# EAGLE design lampica (EAGLE 7.7.0)
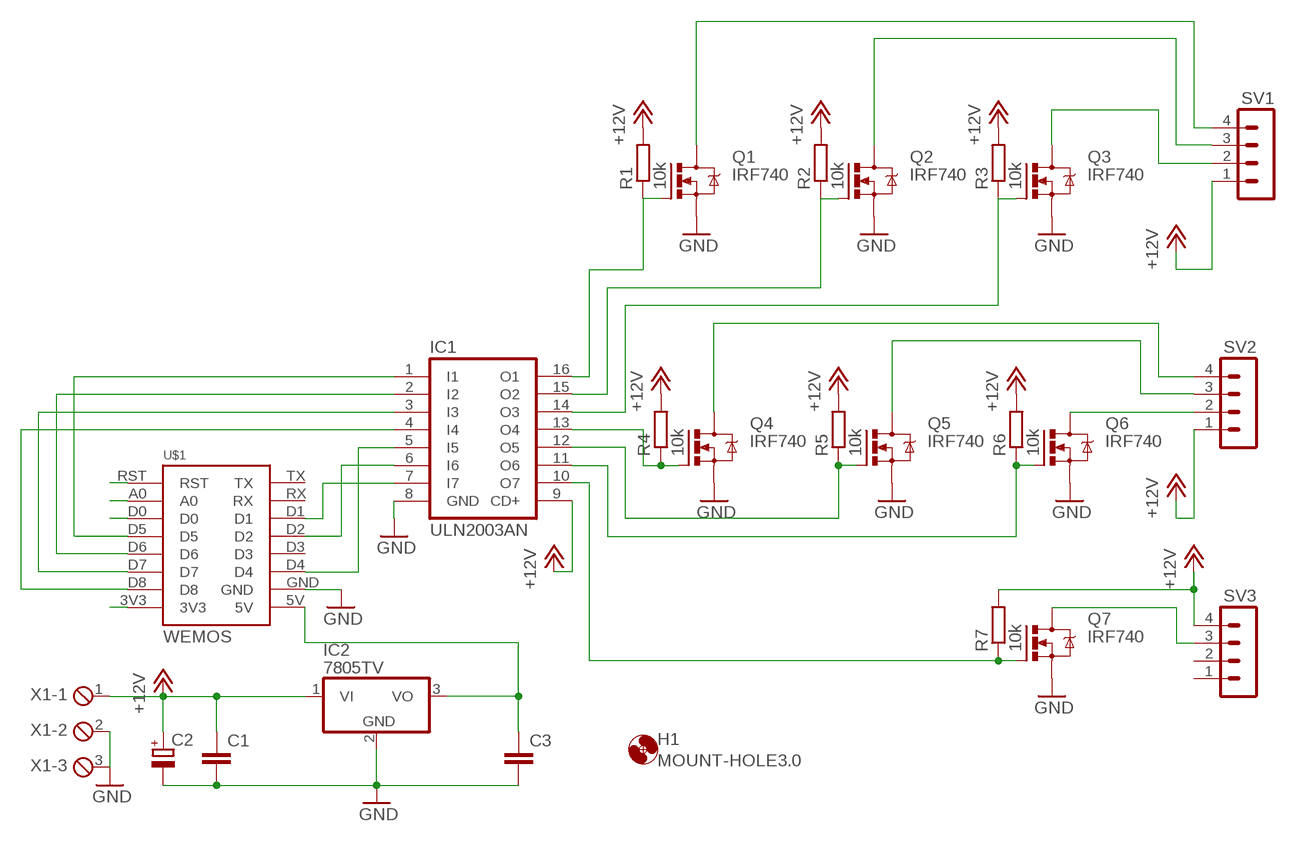
[diagram p0: schematic, sheet 1]

## Parts
C1  C-EU050-025X075  [C050-025X075]
C2  CPOL-EUE5-8.5  [E5-8,5]
C3  C-EU050-025X075  [C050-025X075]
H1  MOUNT-HOLE3.0  [3,0]
IC1  ULN2003AN  [DIL16]
IC2  7805TV  [TO220V]
Q1  IRF740  [TO220BV]
Q2  IRF740  [TO220BV]
Q3  IRF740  [TO220BV]
Q4  IRF740  [TO220BV]
Q5  IRF740  [TO220BV]
Q6  IRF740  [TO220BV]
Q7  IRF740  [TO220BV]
R1  10k  R-EU_0207/7  [0207/7]
R2  10k  R-EU_0207/7  [0207/7]
R3  10k  R-EU_0207/7  [0207/7]
R4  10k  R-EU_0207/10  [0207/10]
R5  10k  R-EU_0207/7  [0207/7]
R6  10k  R-EU_0207/7  [0207/7]
R7  10k  R-EU_0207/7  [0207/7]
SV1  MA04-1  [MA04-1]
SV2  MA04-1  [MA04-1]
SV3  MA04-1  [MA04-1]
U$1  WEMOS  [WEMOS]
X1  MPT3  [3POL254]

## Nets
+12V: C1.1 C2.+ IC1.9(CD+) IC2.1(VI) R1.2 R2.2 R3.2 R4.2 R5.2 R6.2 R7.2 SV1.1 SV2.1 SV3.4 X1.1
GND: C1.2 C2.- C3.2 IC1.8(GND) IC2.2(GND) Q1.S Q2.S Q3.S Q4.S Q5.S Q6.S Q7.S U$1.GND X1.2 X1.3
N$1: IC1.4(I4) U$1.D8
N$2: IC1.3(I3) U$1.D7
N$3: C3.1 IC2.3(VO) U$1.5V
N$4: IC1.2(I2) U$1.D6
N$5: IC1.1(I1) U$1.D5
N$6: IC1.5(I5) U$1.D4
N$7: IC1.6(I6) U$1.D2
N$8: IC1.7(I7) U$1.D1
N$9: IC1.11(O6) Q6.G R6.1
N$10: IC1.14(O3) Q3.G R3.1
N$11: IC1.12(O5) Q5.G R5.1
N$12: IC1.13(O4) Q4.G R4.1
N$13: Q4.D SV2.4
N$14: Q5.D SV2.3
N$15: Q6.D SV2.2
N$16: IC1.10(O7) Q7.G R7.1
N$17: Q7.D SV3.3
N$18: IC1.15(O2) Q2.G R2.1
N$19: IC1.16(O1) Q1.G R1.1
N$20: Q1.D SV1.4
N$21: U$1.A0
N$22: Q2.D SV1.3
N$23: Q3.D SV1.2
N$24: U$1.D0
N$29: U$1.3V3
N$30: U$1.RST
Unconnected: SV3.1 SV3.2 U$1.D3 U$1.RX U$1.TX

## Library data of the parts
C1 C3 = rcl:C-EU: CAPACITOR, European symbol
C2 = rcl:CPOL-EU: POLARIZED CAPACITOR, European symbol
H1 = holes:MOUNT-HOLE: MOUNTING HOLE with drill center marker
IC1 = uln-udn:ULN2003A: DRIVER ARRAY
IC2 = linear:78*: Positive VOLTAGE REGULATOR Source: http://cache.national.com/ds/LM/LM78L05.pdf http://www.fairchildsemi.com/ds/LM/LM7805.pdf
Q1-Q7 = transistor-power:IRF740: N-CHANNEL MOS FET
R1-R7 = rcl:R-EU_: RESISTOR, European symbol
SV1-SV3 = con-lstb:MA04-1: PIN HEADER; OC_FARNELL: unknown; OC_NEWARK: unknown
U$1 = 1455413453956-wemos:WEMOS
X1 = con-phoenix-254:MPT3: PHOENIX CONNECTOR; OC_FARNELL: unknown; OC_NEWARK: unknown

## Board
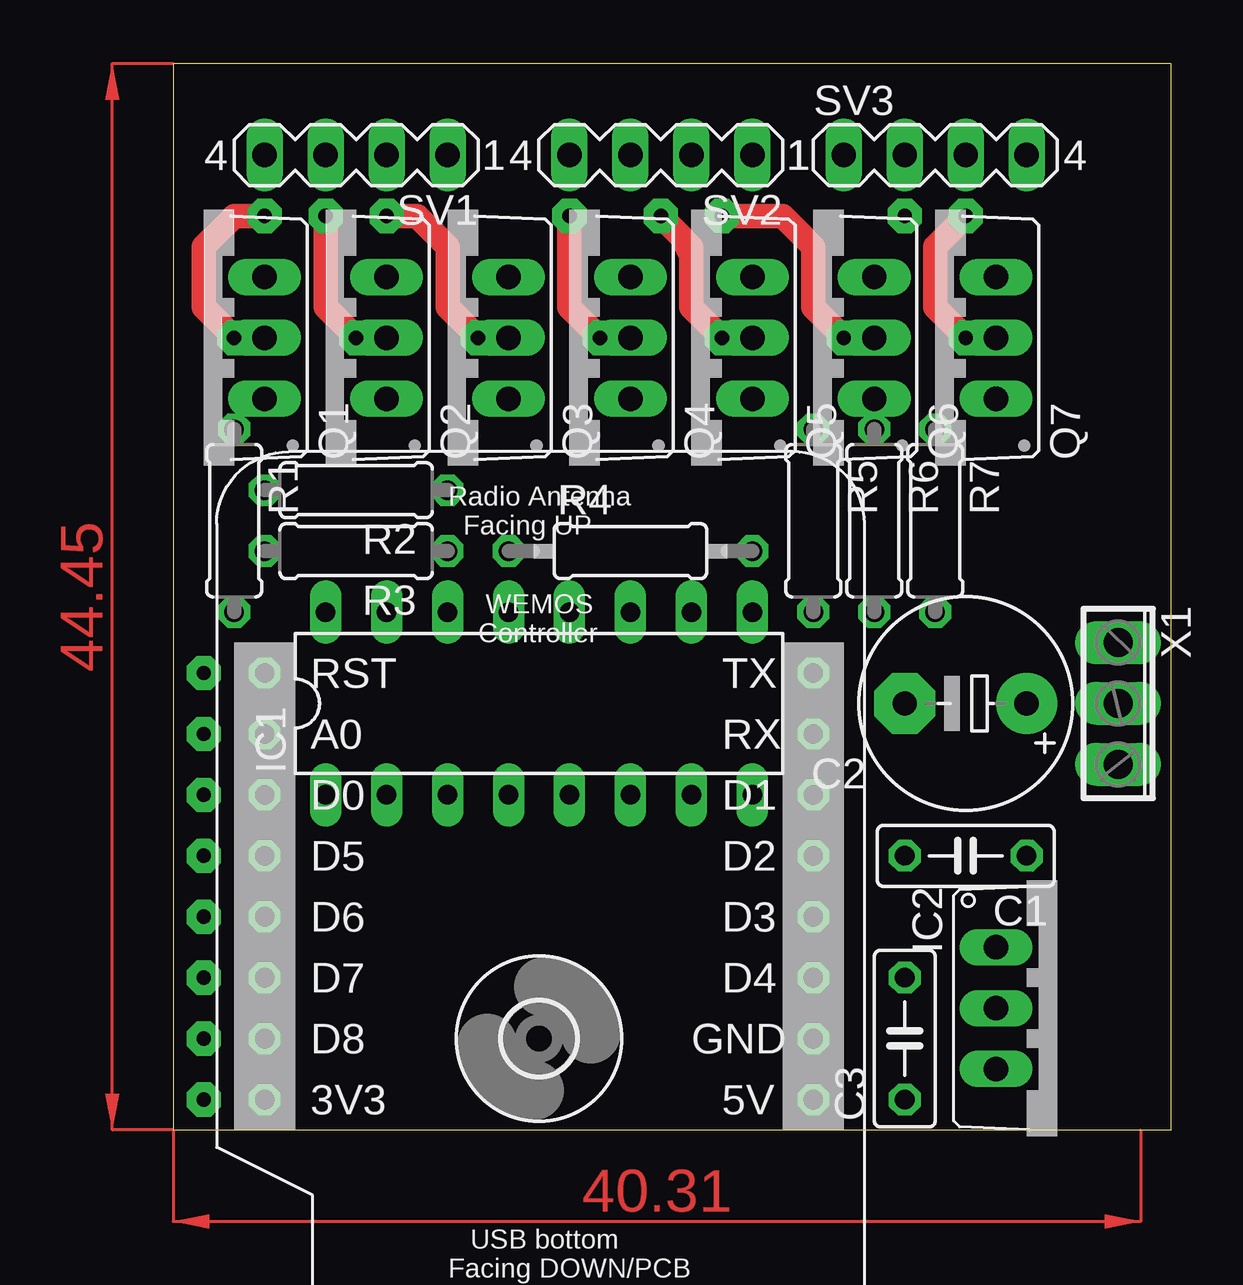
[diagram p1: board, top side]
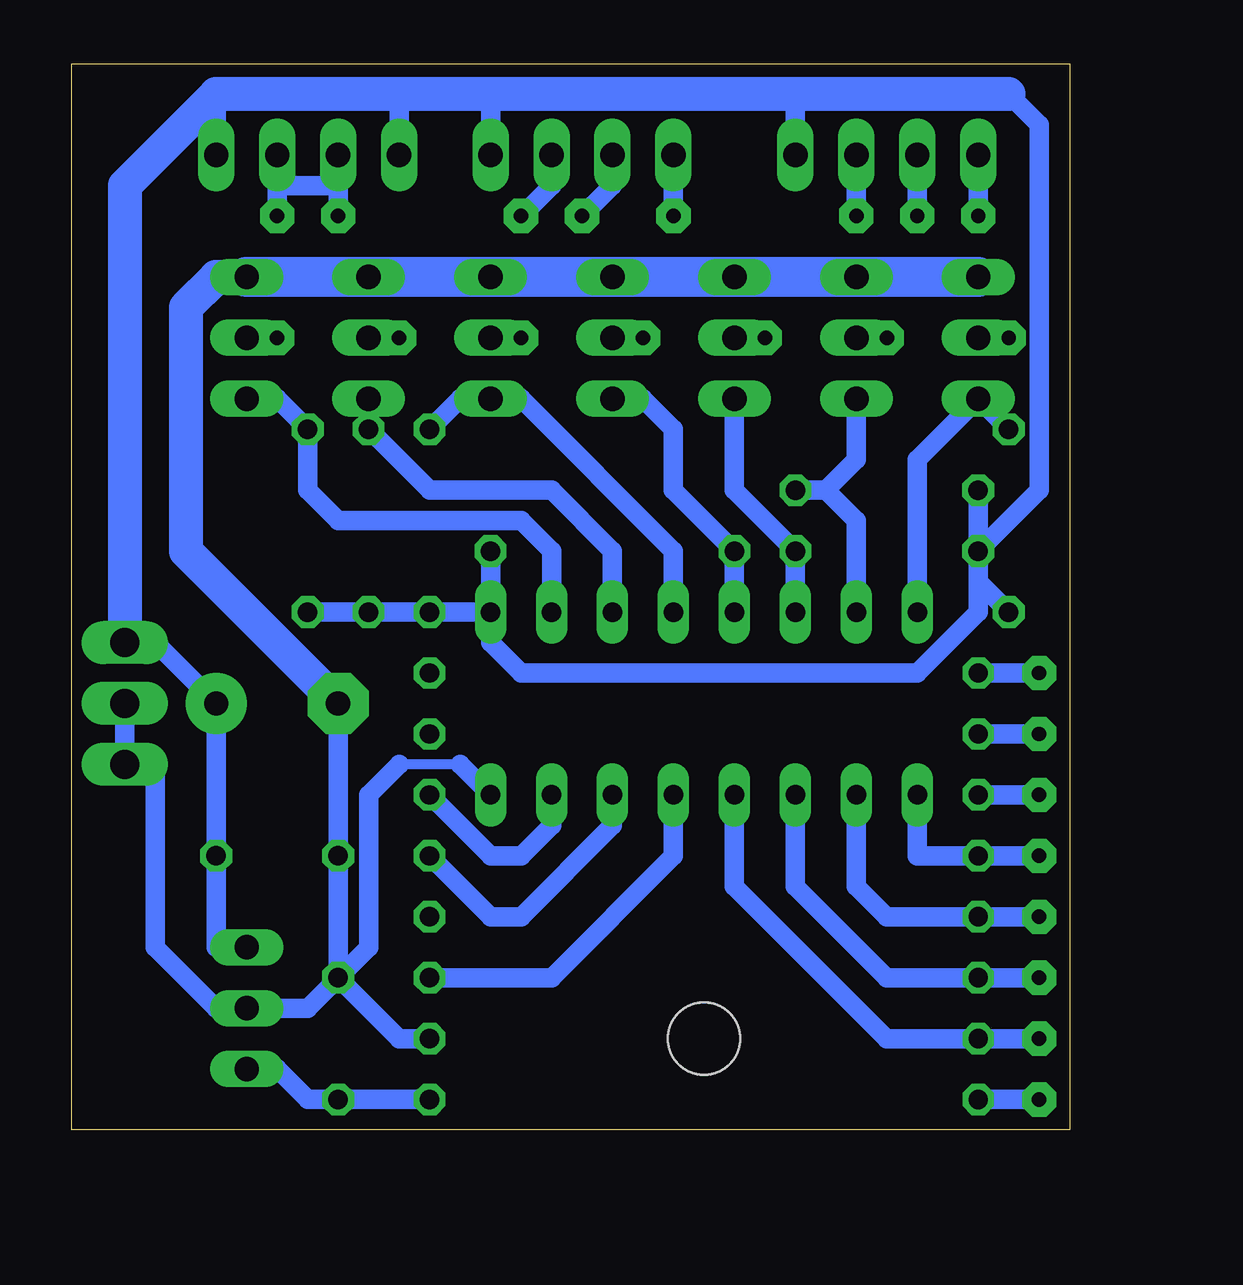
[diagram p2: board, bottom side, seen from below]

Size 41.58 x 44.44 mm. Coordinates in mm from the lower left corner, seen from the top.
Outline: 0,0 41.58,0 41.58,44.44 0,44.44 0,0
Copper layers (1*16): Top 0.035mm / dielectric 1.5mm / Bottom 0.035mm
Design rules "default": minimum track width 10mil, minimum drill 24mil, track to track 8mil, track to pad 8mil, pad to pad 8mil, via to via 8mil, smd to smd 8mil, copper to edge 40mil, drill to drill 8mil, minimum pad ring 10mil, minimum via ring 8mil, stop-mask expansion 4mil, vias tented up to drill 0mil, thermal gap 10mil

### Footprints (pad centres in the part's own frame; a part is rotated, then mirrored left to right if it is on the bottom)
C050-025X075 = drill 0.813 octagon: 1 -2.54,0; 2 2.54,0
E5-8,5 = drill 1.016 pad 2.54: + -2.54,0 | drill 1.016 pad 2.54 octagon: - 2.54,0
3,0 = hole 3: 0,0
DIL16 = drill 0.813 long: 1 -8.89,-3.81; 2 -6.35,-3.81; 3 -3.81,-3.81; 4 -1.27,-3.81; 5 1.27,-3.81; 6 3.81,-3.81; 7 6.35,-3.81; 8 8.89,-3.81; 9 8.89,3.81; 10 6.35,3.81; 11 3.81,3.81; 12 1.27,3.81; 13 -1.27,3.81; 14 -3.81,3.81; 15 -6.35,3.81; 16 -8.89,3.81
TO220V = drill 1.016 long: 1 -2.54,-2.54; 2 0,-2.54; 3 2.54,-2.54
TO220BV = drill 1.016 long: D 0,-2.54; G -2.54,-2.54; S 2.54,-2.54
0207/7 = drill 0.813 octagon: 1 -3.81,0; 2 3.81,0
0207/10 = drill 0.813 octagon: 1 -5.08,0; 2 5.08,0
MA04-1 = drill 1.016 long: 1 -3.81,0; 2 -1.27,0; 3 1.27,0; 4 3.81,0
WEMOS = drill 0.8 octagon: 3V3 0,0; 5V 22.86,0; A0 0,15.24; D0 0,12.7; D1 22.86,12.7; D2 22.86,10.16; D3 22.86,7.62; D4 22.86,5.08; D5 0,10.16; D6 0,7.62; D7 0,5.08; D8 0,2.54; GND 22.86,2.54; RST 0,17.78; RX 22.86,15.24; TX 22.86,17.78
3POL254 = drill 1.2 long: 1 -2.54,0; 2 0,0; 3 2.54,0

### Placement (x,y rotation side)
C1  33.02,11.43 180 top
C2  33.02,17.78 180 top
C3  30.48,3.81 90 top
H1  15.24,3.81 0 top
IC1  15.24,17.78 0 top
IC2  36.83,5.08 270 top
Q1  1.27,33.02 90 top
Q2  6.35,33.02 90 top
Q3  11.43,33.02 90 top
Q4  16.51,33.02 90 top
Q5  21.59,33.02 90 top
Q6  26.67,33.02 90 top
Q7  31.75,33.02 90 top
R1  2.54,25.4 270 top
R2  7.62,26.67 180 top
R3  7.62,24.13 180 top
R4  19.05,24.13 0 top
R5  26.67,25.4 270 top
R6  29.21,25.4 270 top
R7  31.75,25.4 270 top
SV1  7.62,40.64 180 top
SV2  20.32,40.64 180 top
SV3  31.75,40.64 0 top
U$1  3.81,1.27 0 top
X1  39.37,17.78 270 top

### Tracks (layer width: path | path; a pad name or v marks a point on that pad's centre or on a via)
+12V
  Bottom 0.813: IC2.1 35.56,7.62 C1.1 C2.+ 38.1,20.32 X1.1 | R2.2 R3.2 | R3.2 3.81,22.86 R1.2 | IC1.9 24.13,20.32 22.86,19.05 6.35,19.05 3.81,21.59 R3.2 | IC1.9 R5.2 R6.2 R7.2 | R4.2 IC1.9 | R3.2 1.27,26.67 1.27,41.91 2.54,43.18 11.43,43.18 | 27.94,43.18 35.56,43.18 SV3.4 | 27.94,43.18 24.13,43.18 | 24.13,43.18 11.43,43.18 | SV1.1 11.43,43.18 | SV2.1 24.13,43.18 | 27.94,43.18 27.94,41.91
  Bottom 1.422: 2.54,43.18 35.56,43.18 39.37,39.37 X1.1
GND
  Bottom 0.406: 25.4,15.24 27.94,15.24
  Bottom 0.813: U$1.GND 27.94,3.81 C3.2 | IC1.8 25.4,15.24 | C3.2 29.21,7.62 29.21,13.97 27.94,15.24 | C3.2 31.75,5.08 IC2.2 35.56,5.08 38.1,7.62 38.1,15.24 X1.3 X1.2 | C2.- C1.2 C3.2 | Q1.S Q2.S Q3.S Q4.S Q5.S Q6.S Q7.S
  Bottom 1.422: Q7.S 35.56,35.56 36.83,34.29 36.83,24.13 C2.-
  Bottom 1.676: Q1.S Q7.S
N$1  (via drill 0.6 pad 1.42)
  Bottom 0.813: IC1.4 13.97,10.16 7.62,3.81 U$1.D8 v1.27,3.81
N$2  (via drill 0.6 pad 1.42)
  Bottom 0.813: IC1.3 11.43,10.16 7.62,6.35 U$1.D7 v1.27,6.35
N$3
  Bottom 0.813: U$1.5V C3.1 31.75,1.27 33.02,2.54 IC2.3
N$4  (via drill 0.6 pad 1.42)
  Bottom 0.813: IC1.2 8.89,10.16 7.62,8.89 U$1.D6 v1.27,8.89
N$5  (via drill 0.6 pad 1.42)
  Bottom 0.813: IC1.1 6.35,11.43 U$1.D5 v1.27,11.43
N$6
  Bottom 0.813: IC1.5 16.51,11.43 21.59,6.35 U$1.D4
N$7
  Bottom 0.813: U$1.D2 24.13,8.89 22.86,8.89 19.05,12.7 IC1.6
N$8
  Bottom 0.813: IC1.7 21.59,12.7 22.86,11.43 24.13,11.43 U$1.D1
N$9
  Bottom 0.813: IC1.11 19.05,24.13 21.59,26.67 26.67,26.67 R6.1 Q6.G
N$10
  Bottom 0.813: IC1.14 R3.1 13.97,26.67 Q3.G
N$11
  Bottom 0.813: IC1.12 16.51,24.13 22.86,30.48 Q5.G 25.4,30.48 R5.1
N$12
  Bottom 0.813: IC1.13 R4.1 16.51,26.67 16.51,29.21 17.78,30.48 Q4.G
N$13  (via drill 0.6 pad 1.42)
  Top 1.016: v16.51,38.1 16.51,34.29 v17.78,33.02 Q4.D
  Bottom 0.813: SV2.4 v16.51,38.1
N$14  (via drill 0.6 pad 1.42)
  Top 0.254: v20.32,38.1 21.59,35.56 | v22.86,33.02 Q5.D
  Top 1.016: v22.86,33.02 21.59,34.29 21.59,35.56 21.59,36.83 v20.32,38.1
  Bottom 0.813: SV2.3 19.05,39.37 v20.32,38.1
N$15  (via drill 0.6 pad 1.42)
  Top 1.016: v22.86,38.1 25.4,38.1 26.67,36.83 26.67,34.29 v27.94,33.02 Q6.D
  Bottom 0.813: SV2.2 21.59,39.37 v22.86,38.1
N$16
  Bottom 0.813: IC1.10 21.59,24.13 22.86,25.4 30.48,25.4 31.75,26.67 R7.1 33.02,30.48 Q7.G
N$17  (via drill 0.6 pad 1.42)
  Top 1.016: v33.02,38.1 31.75,36.83 31.75,34.29 v33.02,33.02 Q7.D
  Bottom 0.813: SV3.3 33.02,39.37 | 33.02,39.37 v33.02,38.1 | v30.48,38.1 30.48,39.37 33.02,39.37
N$18
  Bottom 0.813: IC1.15 8.89,25.4 10.16,26.67 | R2.1 10.16,26.67 | 10.16,26.67 8.89,27.94 Q2.G
N$19
  Bottom 0.813: IC1.16 6.35,27.94 Q1.G R1.1
N$20  (via drill 0.6 pad 1.42)
  Top 1.016: v3.81,38.1 2.54,38.1 1.27,36.83 1.27,34.29 v2.54,33.02 Q1.D
  Bottom 0.813: SV1.4 v3.81,38.1
N$21  (via drill 0.6 pad 1.42)
  Bottom 0.813: U$1.A0 v1.27,16.51
N$22  (via drill 0.6 pad 1.42)
  Top 1.016: v6.35,38.1 6.35,34.29 v7.62,33.02 Q2.D
  Bottom 0.813: SV1.3 v6.35,38.1
N$23  (via drill 0.6 pad 1.42)
  Top 1.016: v8.89,38.1 10.16,38.1 11.43,36.83 11.43,34.29 v12.7,33.02 Q3.D
  Bottom 0.813: SV1.2 v8.89,38.1
N$24  (via drill 0.6 pad 1.42)
  Bottom 0.813: U$1.D0 v1.27,13.97
N$29  (via drill 0.6 pad 1.42)
  Bottom 0.813: U$1.3V3 v1.27,1.27
N$30  (via drill 0.6 pad 1.42)
  Bottom 0.813: U$1.RST v1.27,19.05
(copper drawn outside any net)
  shapes: Top area x2